# EAGLE schematic Power Up 4.0 (EAGLE 7.6.0)
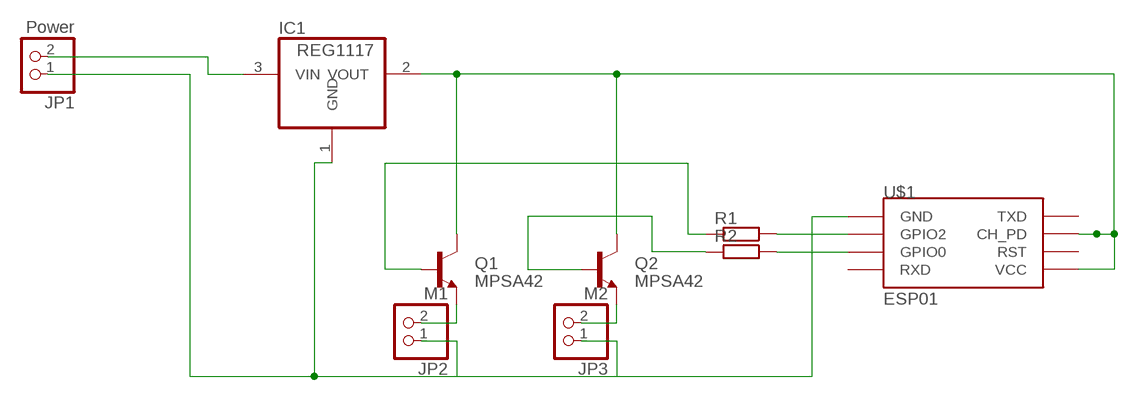
[diagram p0: schematic, sheet 1]

## Parts
IC1  REG1117  [SOT223]
JP1  Power  PINHD-1X2  [1X02]
JP2  M1  PINHD-1X2  [1X02]
JP3  M2  PINHD-1X2  [1X02]
Q1  MPSA42  TRANSISTOR_NPNMPSA42  [SOT23-3]
Q2  MPSA42  TRANSISTOR_NPNMPSA42  [SOT23-3]
R1  SMR-WAV  [SMS-WAV]
R2  SMR-WAV  [SMS-WAV]
U$1  ESP01  [ESP01]

## Nets
N$1: Q1.1(B) R1.2
N$2: Q2.1(B) R2.2
N$3: IC1.1(GND) JP1.1 JP2.1 JP3.1 U$1.GND
N$4: IC1.2(VOUT) Q1.3(C) Q2.3(C) U$1.CH_PD U$1.VCC
N$5: IC1.3(VIN) JP1.2
N$6: R1.1 U$1.GPIO2
N$7: R2.1 U$1.GPIO0
N$8: JP2.2 Q1.2(E)
N$9: JP3.2 Q2.2(E)
Unconnected: U$1.RST U$1.RX(RXD) U$1.TX(TXD)

## Library data of the parts
IC1 = burr-brown:REG1117: 800mA and 1A Low Dropout (LDO) Positive Regulator 1.8V, 2.5V, 2.85V, 3.3V, 5V, and Adj; MPN: REG1117; OC_FARNELL: 1097566; OC_NEWARK: 14P6981
JP1-JP3 = pinhead:PINHD-1X2: PIN HEADER
Q1 Q2 = SparkFun-DiscreteSemi:TRANSISTOR_NPN: Generic NPN BJT MMBT2222A - TRANS-08049 (SOT-23, 1A 40V) MPSA42 - TRANS-09116 (SOT-23, 500mA 300V) MMBT5088LT1G - TRANS-11160 (SOT-23, 50 mA 30V) BC547 - COM-08928 <http://www.sparkfun.com/products/8928> (TO-92 45V 100mA) (1.Collector 2.Base 3.Emitter) 2N3904 - COM-00521 <http://www.sparkfun.com/products/521> (TO-92 40V 200mA) (1.Emitter 2.Base 3.Collector) P2N2222A - COM-12852 <http://www.sparkfun.com/products/12852> (TO-92 40V 600mA) (1.Collector 2.Base 3.Emitter); PROD_ID: TRANS-09116
R1 R2 = resistor-shunt:SMR-WAV: SMD SHUNT RESISTOR; OC_FARNELL: unknown; OC_NEWARK: unknown
U$1 = esp8266modules:ESP01: ESP8266 Wifi module 01